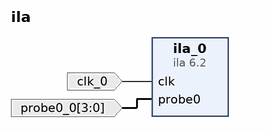
[diagram p0: block diagram of the top level]
# Vivado block design ila, xc7a35ticsg324-1L, Vivado 2025.1
create_bd_design ila

create_bd_port -dir I -type clk clk_0
create_bd_port -dir I -from 3 -to 0 probe0_0

create_bd_cell -type ip -vlnv xilinx.com:ip:ila:6.2 ila_0
set_property -dict {CONFIG.C_MONITOR_TYPE Native CONFIG.C_PROBE0_WIDTH 4} [get_bd_cells ila_0]

# ---- connections ----

connect_bd_net -net clk_0_1 [get_bd_ports clk_0] [get_bd_pins ila_0/clk]
connect_bd_net -net probe0_0_1 [get_bd_ports probe0_0] [get_bd_pins ila_0/probe0]

validate_bd_design
save_bd_design
